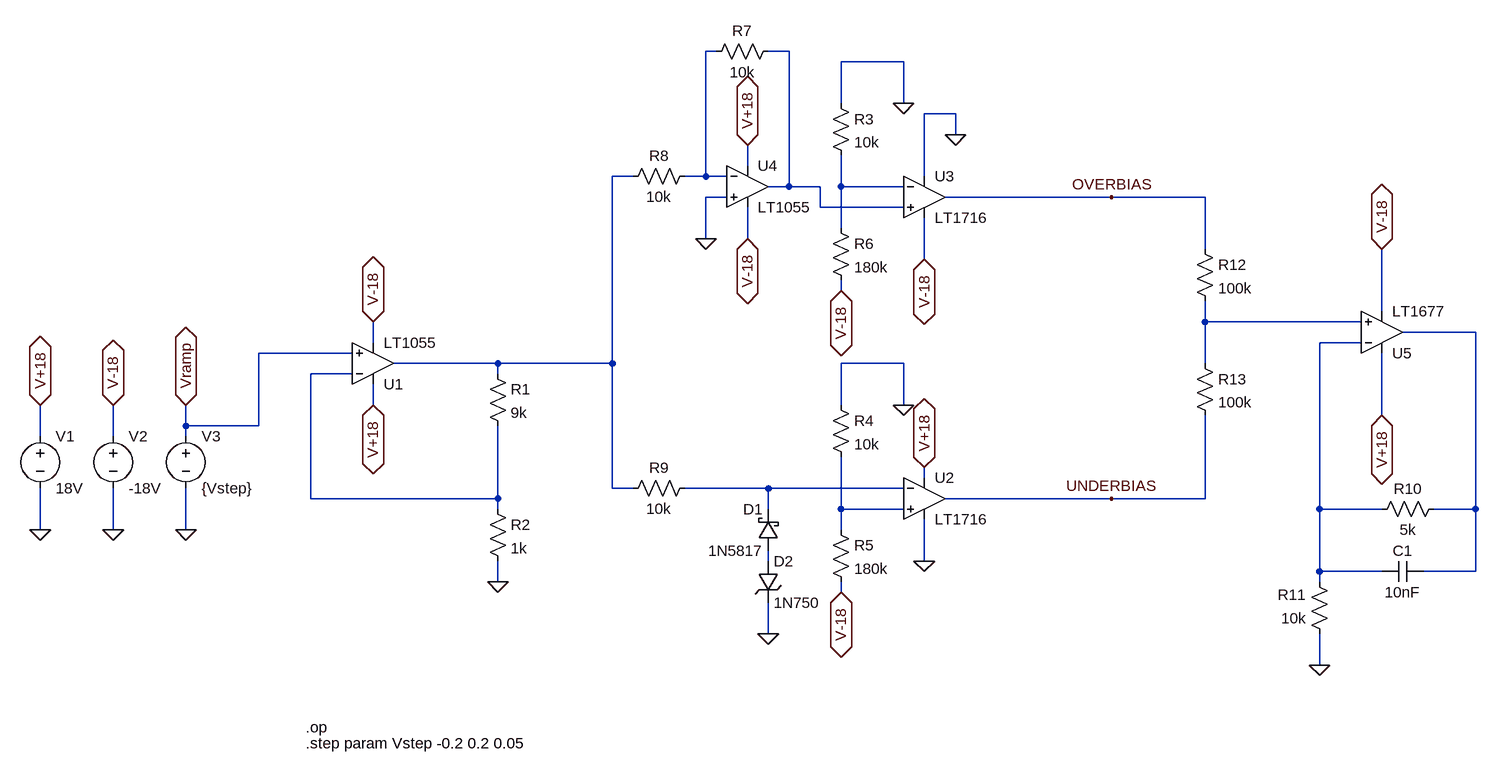
[diagram p0: schematic offset-charge-balancer.asc]
offset-charge-balancer.asc, the LTspice schematic file:
Version 4
SHEET 1 1288 680
WIRE 112 -480 96 -480
WIRE 224 -480 192 -480
WIRE 400 -464 304 -464
WIRE 304 -400 304 -464
WIRE 400 -400 400 -464
WIRE 480 -384 432 -384
WIRE 480 -352 480 -384
WIRE 160 -304 160 -336
WIRE -16 -288 -48 -288
WIRE 96 -288 96 -480
WIRE 96 -288 64 -288
WIRE 128 -288 96 -288
WIRE 432 -288 432 -384
WIRE 224 -272 224 -480
WIRE 224 -272 192 -272
WIRE 272 -272 224 -272
WIRE 304 -272 304 -320
WIRE 400 -272 304 -272
WIRE 128 -256 96 -256
WIRE 720 -256 464 -256
WIRE 864 -256 720 -256
WIRE 272 -240 272 -272
WIRE 400 -240 272 -240
WIRE 304 -208 304 -272
WIRE 96 -192 96 -256
WIRE 160 -192 160 -240
WIRE 864 -176 864 -256
WIRE 432 -160 432 -224
WIRE 304 -112 304 -128
WIRE 1136 -80 1136 -176
WIRE 864 -64 864 -96
WIRE 1104 -64 864 -64
WIRE 1280 -48 1168 -48
WIRE -416 -32 -416 -64
WIRE 1104 -32 1040 -32
WIRE -448 -16 -592 -16
WIRE -224 0 -384 0
WIRE -48 0 -48 -288
WIRE -48 0 -224 0
WIRE 400 0 304 0
WIRE 864 0 864 -64
WIRE -448 16 -512 16
WIRE -224 16 -224 0
WIRE -416 64 -416 32
WIRE 304 64 304 0
WIRE 400 64 400 0
WIRE 1136 80 1136 -16
WIRE -704 96 -704 64
WIRE -592 96 -592 -16
WIRE -592 96 -704 96
WIRE -928 112 -928 64
WIRE -816 112 -816 64
WIRE -704 112 -704 96
WIRE 432 176 432 160
WIRE -48 192 -48 0
WIRE -16 192 -48 192
WIRE 192 192 64 192
WIRE 400 192 192 192
WIRE -512 208 -512 16
WIRE -224 208 -224 96
WIRE -224 208 -512 208
WIRE 720 208 464 208
WIRE 864 208 864 80
WIRE 864 208 720 208
WIRE -224 224 -224 208
WIRE 192 224 192 192
WIRE 304 224 304 144
WIRE 400 224 304 224
WIRE 1040 224 1040 -32
WIRE 1136 224 1040 224
WIRE 1280 224 1280 -48
WIRE 1280 224 1216 224
WIRE -928 256 -928 192
WIRE -816 256 -816 192
WIRE -704 256 -704 192
WIRE 304 256 304 224
WIRE 192 304 192 288
WIRE 432 304 432 240
WIRE 1040 320 1040 224
WIRE 1136 320 1040 320
WIRE 1280 320 1280 224
WIRE 1280 320 1200 320
WIRE -224 336 -224 304
WIRE 1040 336 1040 320
WIRE 304 352 304 336
WIRE 192 416 192 368
WIRE 1040 464 1040 416
FLAG -224 336 0
FLAG -416 -64 V-18
IOPIN -416 -64 BiDir
FLAG -416 64 V+18
IOPIN -416 64 BiDir
FLAG 400 64 0
FLAG 304 352 V-18
IOPIN 304 352 BiDir
FLAG 432 160 V+18
IOPIN 432 160 BiDir
FLAG 720 -256 OVERBIAS
FLAG 720 208 UNDERBIAS
FLAG -928 256 0
FLAG -816 256 0
FLAG -928 64 V+18
IOPIN -928 64 BiDir
FLAG -816 64 V-18
IOPIN -816 64 BiDir
FLAG -704 256 0
FLAG -704 64 Vramp
IOPIN -704 64 BiDir
FLAG 96 -192 0
FLAG 160 -192 V-18
IOPIN 160 -192 BiDir
FLAG 160 -336 V+18
IOPIN 160 -336 BiDir
FLAG 432 304 0
FLAG 400 -400 0
FLAG 304 -112 V-18
IOPIN 304 -112 BiDir
FLAG 480 -352 0
FLAG 432 -160 V-18
IOPIN 432 -160 BiDir
FLAG 192 416 0
FLAG 1040 464 0
FLAG 1136 80 V+18
IOPIN 1136 80 BiDir
FLAG 1136 -176 V-18
IOPIN 1136 -176 BiDir
SYMBOL Opamps\\LT1055 -416 64 M180
SYMATTR InstName U1
SYMBOL res -240 0 R0
SYMATTR InstName R1
SYMATTR Value 9k
SYMBOL res -240 208 R0
SYMATTR InstName R2
SYMATTR Value 1k
SYMBOL res 288 48 R0
SYMATTR InstName R4
SYMATTR Value 10k
SYMBOL res 288 240 R0
SYMATTR InstName R5
SYMATTR Value 180k
SYMBOL voltage -928 96 R0
WINDOW 123 0 0 Left 2
WINDOW 39 0 0 Left 2
SYMATTR InstName V1
SYMATTR Value 18V
SYMBOL voltage -816 96 R0
WINDOW 123 0 0 Left 2
WINDOW 39 0 0 Left 2
SYMATTR InstName V2
SYMATTR Value -18V
SYMBOL voltage -704 96 R0
WINDOW 123 0 0 Left 2
WINDOW 39 0 0 Left 2
SYMATTR InstName V3
SYMATTR Value {Vstep}
SYMBOL Opamps\\LT1055 160 -336 R0
SYMATTR InstName U4
SYMBOL res 208 -496 R90
WINDOW 0 0 56 VBottom 2
WINDOW 3 32 56 VTop 2
SYMATTR InstName R7
SYMATTR Value 10k
SYMBOL res 80 -304 R90
WINDOW 0 0 56 VBottom 2
WINDOW 3 32 56 VTop 2
SYMATTR InstName R8
SYMATTR Value 10k
SYMBOL res 80 176 R90
WINDOW 0 0 56 VBottom 2
WINDOW 3 32 56 VTop 2
SYMATTR InstName R9
SYMATTR Value 10k
SYMBOL Comparators\\LT1716 432 208 R0
SYMATTR InstName U2
SYMBOL res 288 -416 R0
SYMATTR InstName R3
SYMATTR Value 10k
SYMBOL res 288 -224 R0
SYMATTR InstName R6
SYMATTR Value 180k
SYMBOL Comparators\\LT1716 432 -256 R0
SYMATTR InstName U3
SYMBOL schottky 208 288 R180
WINDOW 0 24 64 Left 2
WINDOW 3 24 0 Left 2
SYMATTR InstName D1
SYMATTR Value 1N5817
SYMBOL zener 176 304 R0
SYMATTR InstName D2
SYMATTR Value 1N750
SYMBOL Opamps\\LT1677 1136 16 M180
SYMATTR InstName U5
SYMBOL res 1232 208 R90
WINDOW 0 0 56 VBottom 2
WINDOW 3 32 56 VTop 2
SYMATTR InstName R10
SYMATTR Value 5k
SYMBOL res 1056 432 R180
WINDOW 0 36 76 Left 2
WINDOW 3 36 40 Left 2
SYMATTR InstName R11
SYMATTR Value 10k
SYMBOL cap 1200 304 R90
WINDOW 0 0 32 VBottom 2
WINDOW 3 32 32 VTop 2
SYMATTR InstName C1
SYMATTR Value 10nF
SYMBOL res 848 -192 R0
SYMATTR InstName R12
SYMATTR Value 100k
SYMBOL res 848 -16 R0
SYMATTR InstName R13
SYMATTR Value 100k
TEXT -520 560 Left 2 !.op
TEXT -520 584 Left 2 !.step param Vstep -0.2 0.2 0.05

The netlist it stands for:
* offset-charge-balancer.asc
XU1 Vramp N008 V+18 V-18 N003 LT1055  ; pins In+ In- V+ V- OUT
R1 N003 N008 9k
R2 N008 0 1k
R4 0 N010 10k
R5 N010 V-18 180k
V1 V+18 0 18V
V2 V-18 0 -18V
V3 Vramp 0 {Vstep}
XU4 0 N001 V+18 V-18 N002 LT1055  ; pins In+ In- V+ V- OUT
R7 N002 N001 10k
R8 N001 N003 10k
R9 N009 N003 10k
XU2 N010 N009 V+18 0 UNDERBIAS LT1716  ; pins In+ In- V+ V- OUT
R3 0 N004 10k
R6 N004 V-18 180k
XU3 N002 N004 0 V-18 OVERBIAS LT1716  ; pins In+ In- V+ V- OUT
D1 N011 N009 1N5817
D2 N011 0 1N750
XU5 N005 N007 V+18 V-18 N006 LT1677  ; pins In+ In- V+ V- OUT
R10 N006 N007 5k
R11 0 N007 10k
C1 N006 N007 10nF
R12 OVERBIAS N005 100k
R13 N005 UNDERBIAS 100k
.model D D
.lib standard.dio
.op
.step param Vstep -0.2 0.2 0.05
.lib LTC1.lib
.lib LTC.lib
.backanno
.end